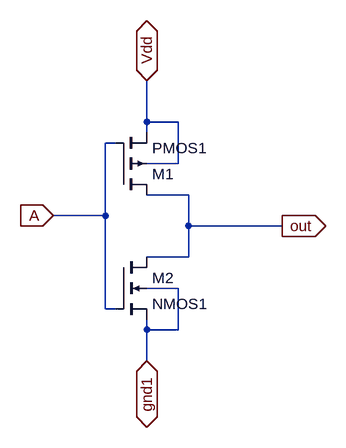
[diagram p0: schematic NOT1.asc]
NOT1.asc, the LTspice schematic file:
Version 4.1
SHEET 1 880 680
WIRE 256 64 256 0
WIRE 304 64 256 64
WIRE 256 80 256 64
WIRE 208 96 192 96
WIRE 304 128 304 64
WIRE 304 128 256 128
WIRE 320 176 256 176
WIRE 192 208 192 96
WIRE 192 208 112 208
WIRE 320 224 320 176
WIRE 464 224 320 224
WIRE 320 272 320 224
WIRE 320 272 256 272
WIRE 304 320 256 320
WIRE 192 352 192 208
WIRE 208 352 192 352
WIRE 256 384 256 368
WIRE 304 384 304 320
WIRE 304 384 256 384
WIRE 256 432 256 384
FLAG 256 432 gnd1
IOPIN 256 432 BiDir
FLAG 256 0 Vdd
IOPIN 256 0 BiDir
FLAG 464 224 out
IOPIN 464 224 Out
FLAG 112 208 A
IOPIN 112 208 In
SYMBOL pmos4 208 176 M180
SYMATTR InstName M1
SYMATTR Value2 l=1u w=4u
SYMATTR Value PMOS1
SYMBOL nmos4 208 272 R0
SYMATTR InstName M2
SYMATTR Value2 l=1u w=4u
SYMATTR Value NMOS1

The netlist it stands for:
* NOT1.asc
M1 out A Vdd Vdd PMOS1 l=1u w=4u
M2 out A gnd1 gnd1 NMOS1 l=1u w=4u
.model NMOS NMOS
.model PMOS PMOS
.lib standard.mos
.backanno
.end